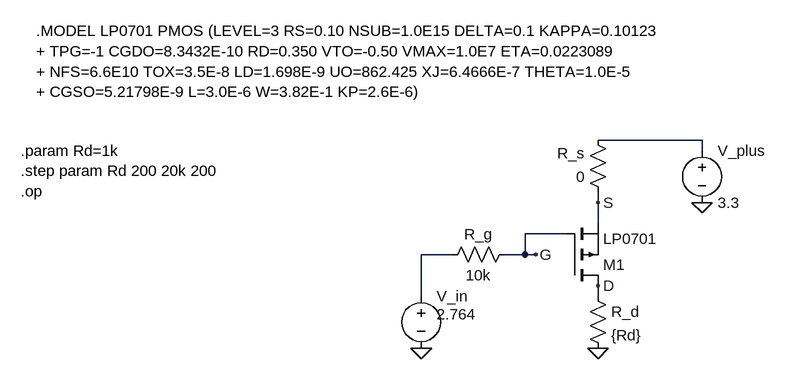
[diagram p0: schematic 3.2_c.asc]
3.2_c.asc, the LTspice schematic file:
Version 4.1
SHEET 1 880 680
WIRE 416 16 256 16
WIRE 416 32 416 16
WIRE 256 112 256 96
WIRE 256 144 256 112
WIRE 208 160 144 160
WIRE 32 192 -16 192
WIRE 144 192 144 160
WIRE 144 192 112 192
WIRE 160 192 144 192
WIRE -16 256 -16 192
WIRE 256 256 256 240
FLAG -16 336 0
FLAG 256 336 0
FLAG 416 112 0
FLAG 256 112 S
FLAG 256 240 D
FLAG 160 192 G
SYMBOL voltage 416 16 R0
SYMATTR InstName V_plus
SYMATTR Value 3.3
SYMBOL res 128 176 R90
WINDOW 0 0 56 VBottom 2
WINDOW 3 32 56 VTop 2
SYMATTR InstName R_g
SYMATTR Value 10k
SYMBOL res 272 112 R180
WINDOW 0 36 76 Left 2
WINDOW 3 36 40 Left 2
SYMATTR InstName R_s
SYMATTR Value 0
SYMBOL res 240 240 R0
SYMATTR InstName R_d
SYMATTR Value {Rd}
SYMBOL pmos 208 240 M180
SYMATTR InstName M1
SYMATTR Value LP0701
SYMBOL voltage -16 240 R0
WINDOW 3 24 44 Left 2
WINDOW 123 0 0 Left 0
WINDOW 39 0 0 Left 0
SYMATTR Value 2.764
SYMATTR InstName V_in
TEXT -608 -152 Left 2 !.MODEL LP0701 PMOS (LEVEL=3 RS=0.10 NSUB=1.0E15 DELTA=0.1 KAPPA=0.10123\n+ TPG=-1 CGDO=8.3432E-10 RD=0.350 VTO=-0.50 VMAX=1.0E7 ETA=0.0223089\n+ NFS=6.6E10 TOX=3.5E-8 LD=1.698E-9 UO=862.425 XJ=6.4666E-7 THETA=1.0E-5\n+ CGSO=5.21798E-9 L=3.0E-6 W=3.82E-1 KP=2.6E-6)
TEXT -632 32 Left 2 !.param Rd=1k\n.step param Rd 200 20k 200\n.op

The netlist it stands for:
* 3.2_c.asc
V_plus N001 0 3.3
R_g G N002 10k
R_s S N001 0
R_d D 0 {Rd}
M1 D G S S LP0701
V_in N002 0 2.764
.model NMOS NMOS
.model PMOS PMOS
.lib standard.mos
.MODEL LP0701 PMOS (LEVEL=3 RS=0.10 NSUB=1.0E15 DELTA=0.1 KAPPA=0.10123
+ TPG=-1 CGDO=8.3432E-10 RD=0.350 VTO=-0.50 VMAX=1.0E7 ETA=0.0223089
+ NFS=6.6E10 TOX=3.5E-8 LD=1.698E-9 UO=862.425 XJ=6.4666E-7 THETA=1.0E-5
+ CGSO=5.21798E-9 L=3.0E-6 W=3.82E-1 KP=2.6E-6)
.param Rd=1k
.step param Rd 200 20k 200
.op
.backanno
.end